# EAGLE design SwitchCanaleDP2024 (EAGLE 6.5.0)
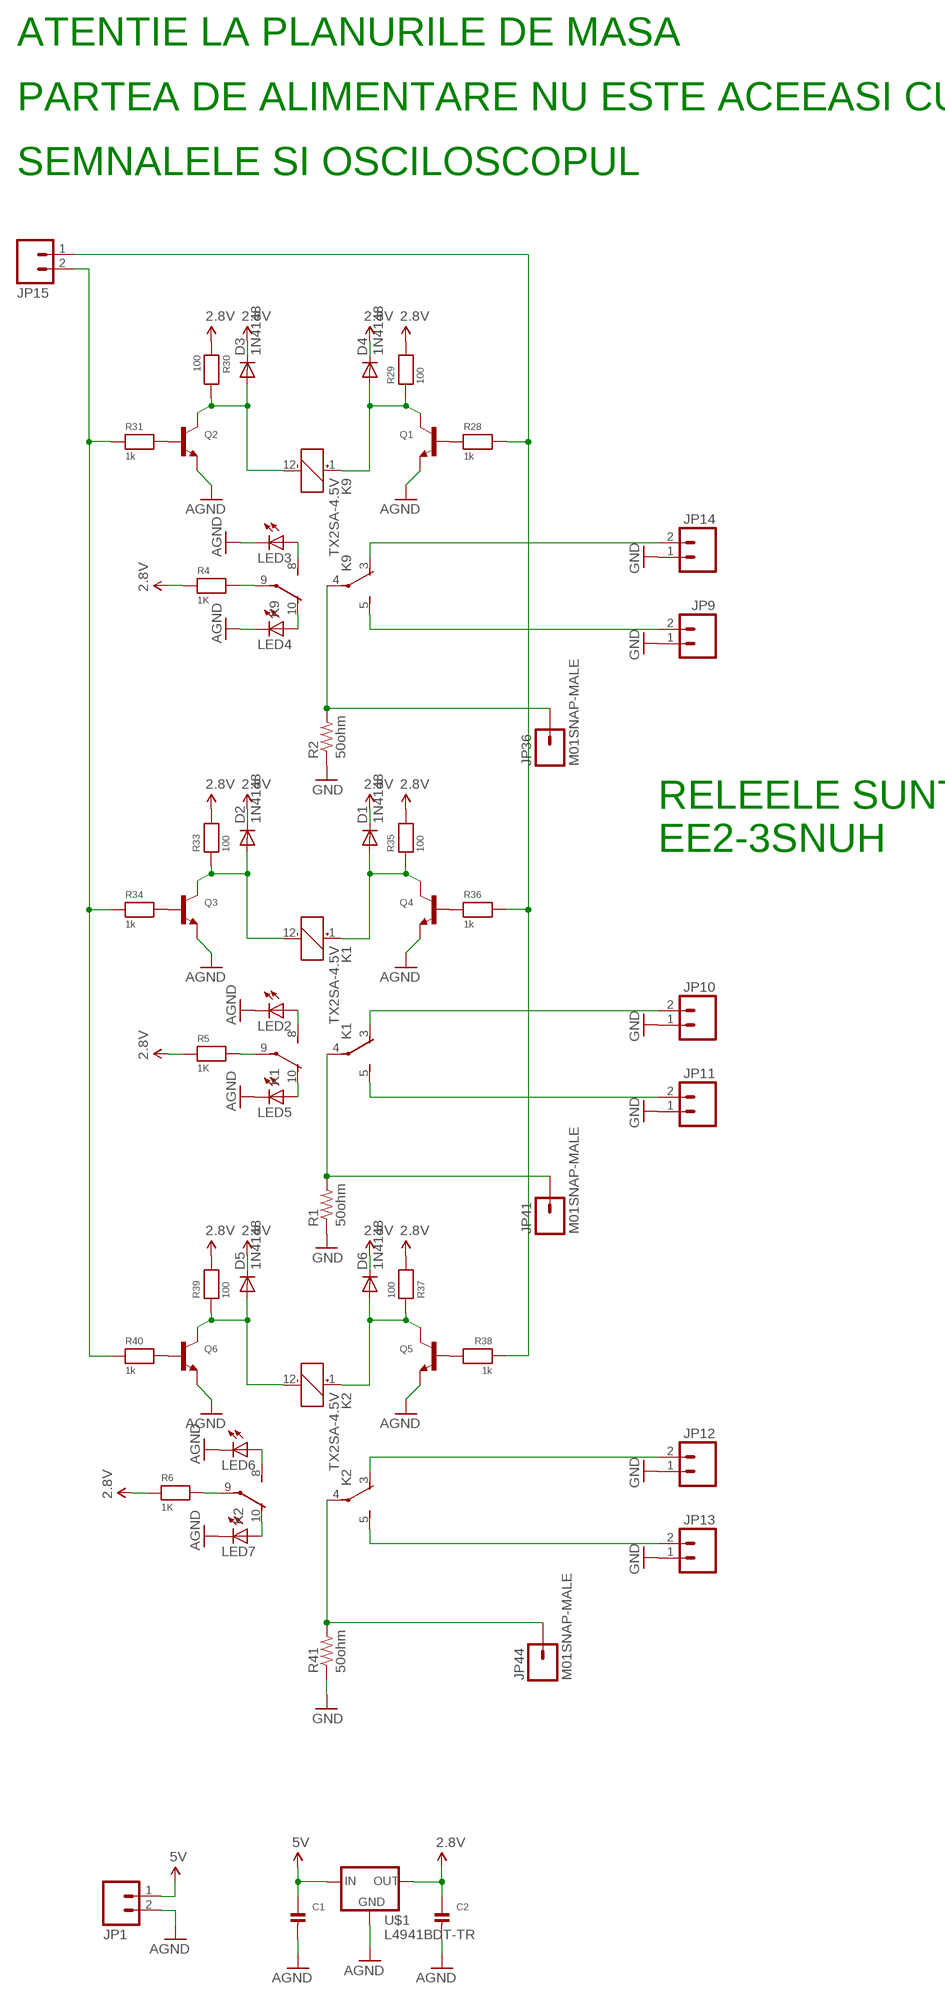
[diagram p0: schematic, sheet 1]

## Parts
C1  CAP_CERAMIC1206  [1206]
C2  CAP_CERAMIC1206  [1206]
D1  1N4148  DIODE-MINIMELF  [MINIMELF]
D2  1N4148  DIODE-MINIMELF  [MINIMELF]
D3  1N4148  DIODE-MINIMELF  [MINIMELF]
D4  1N4148  DIODE-MINIMELF  [MINIMELF]
D5  1N4148  DIODE-MINIMELF  [MINIMELF]
D6  1N4148  DIODE-MINIMELF  [MINIMELF]
JP1  M025MM  [SCREWTERMINAL-5MM-2]
JP9  M025MM  [SCREWTERMINAL-5MM-2]
JP10  M025MM  [SCREWTERMINAL-5MM-2]
JP11  M025MM  [SCREWTERMINAL-5MM-2]
JP12  M025MM  [SCREWTERMINAL-5MM-2]
JP13  M025MM  [SCREWTERMINAL-5MM-2]
JP14  M025MM  [SCREWTERMINAL-5MM-2]
JP15  M025MM  [SCREWTERMINAL-5MM-2]
JP36  M01SNAP-MALE  [SNAP-MALE]
JP41  M01SNAP-MALE  [SNAP-MALE]
JP44  M01SNAP-MALE  [SNAP-MALE]
K1  TX2SA-4.5V  [TX2SA]
K2  TX2SA-4.5V  [TX2SA]
K9  TX2SA-4.5V  [TX2SA]
LED2  LEDCHIP-LED0805  [CHIP-LED0805]
LED3  LEDCHIP-LED0805  [CHIP-LED0805]
LED4  LEDCHIP-LED0805  [CHIP-LED0805]
LED5  LEDCHIP-LED0805  [CHIP-LED0805]
LED6  LEDCHIP-LED0805  [CHIP-LED0805]
LED7  LEDCHIP-LED0805  [CHIP-LED0805]
Q1  TRANSISTOR_NPNWAVE  [SOT23-W]
Q2  TRANSISTOR_NPNWAVE  [SOT23-W]
Q3  TRANSISTOR_NPNWAVE  [SOT23-W]
Q4  TRANSISTOR_NPNWAVE  [SOT23-W]
Q5  TRANSISTOR_NPNWAVE  [SOT23-W]
Q6  TRANSISTOR_NPNWAVE  [SOT23-W]
R1  50ohm  RESISTOR1206  [1206]
R2  50ohm  RESISTOR1206  [1206]
R4  1K  RESISTOR_0805MP  [_0805MP]
R5  1K  RESISTOR_0805MP  [_0805MP]
R6  1K  RESISTOR_0805MP  [_0805MP]
R28  1k  RESISTOR_0805MP  [_0805MP]
R29  100  RESISTOR_0805MP  [_0805MP]
R30  100  RESISTOR_0805MP  [_0805MP]
R31  1k  RESISTOR_0805MP  [_0805MP]
R33  100  RESISTOR_0805MP  [_0805MP]
R34  1k  RESISTOR_0805MP  [_0805MP]
R35  100  RESISTOR_0805MP  [_0805MP]
R36  1k  RESISTOR_0805MP  [_0805MP]
R37  100  RESISTOR_0805MP  [_0805MP]
R38  1k  RESISTOR_0805MP  [_0805MP]
R39  100  RESISTOR_0805MP  [_0805MP]
R40  1k  RESISTOR_0805MP  [_0805MP]
R41  50ohm  RESISTOR1206  [1206]
U$1  L4941BDT-TR  [DPAK]

## Nets
2.8V: C2.1 D1.C D2.C D3.C D4.C D5.C D6.C R4.1 R5.1 R6.1 R29.2 R30.1 R33.2 R35.2 R37.2 R39.2 U$1.2(OUT)
5V: C1.1 JP1.1 U$1.1(IN)
AGND: C1.2 C2.2 JP1.2 LED2.C LED3.C LED4.C LED5.C LED6.C LED7.C Q1.2(E) Q2.2(E) Q3.2(E) Q4.2(E) Q5.2(E) Q6.2(E) U$1.3(GND)
GND: JP9.1 JP10.1 JP11.1 JP12.1 JP13.1 JP14.1 R1.1 R2.1 R41.1
N$1: JP15.2 R31.1 R34.1 R40.1
N$2: D4.A K9.1(_:+) Q1.3(C) R29.1
N$3: K9.8(2:S) LED3.A
N$4: K9.10(2:O) LED4.A
N$5: K9.9(2:P) R4.2
N$6: JP14.2 K9.3(1:O)
N$7: JP9.2 K9.5(1:S)
N$8: JP15.1 R28.2 R36.2 R38.1
N$9: JP12.2 K2.3(1:O)
N$11: K1.8(2:S) LED2.A
N$12: K1.10(2:O) LED5.A
N$13: K2.8(2:S) LED6.A
N$14: K2.10(2:O) LED7.A
N$15: K2.9(2:P) R6.2
N$16: JP36.2 K9.4(1:P) R2.2
N$17: K1.9(2:P) R5.2
N$20: D1.A K1.1(_:+) Q4.3(C) R35.1
N$21: D2.A K1.12(_:-) Q3.3(C) R33.1
N$22: JP10.2 K1.3(1:O)
N$23: JP11.2 K1.5(1:S)
N$24: JP41.2 K1.4(1:P) R1.2
N$29: D6.A K2.1(_:+) Q5.3(C) R37.1
N$32: JP13.2 K2.5(1:S)
N$33: JP44.2 K2.4(1:P) R41.2
N$38: Q5.1(B) R38.2
N$39: Q6.1(B) R40.2
N$40: D5.A K2.12(_:-) Q6.3(C) R39.1
N$41: D3.A K9.12(_:-) Q2.3(C) R30.2
N$42: Q2.1(B) R31.2
N$43: Q1.1(B) R28.1
N$46: Q3.1(B) R34.2
N$49: Q4.1(B) R36.1

## Notes on the sheet
- ATENTIE LA PLANURILE DE MASA
- PARTEA DE ALIMENTARE NU ESTE ACEEASI CU
- SEMNALELE SI OSCILOSCOPUL
- RELEELE SUNT
- EE2-3SNUH

## Library data of the parts
C1 C2 = microbuilder:CAP_CERAMIC: Ceramic Capacitors 0402 - 0402 Surface Mount Capacitors 16pF 50V 5% [Digikey: 445-4899-2-ND] 18pF 50V 5% [Digikey: 490-1281-2-ND] 22pF 50V 5% [Digikey: 490-1283-2-ND] 68pF 50V 5% [Digikey: 490-1289-2-ND] 0.1uF 10V 10% [Digikey: 490-1318-2-ND] 1.0uF 6.3V 10% [Digikey: 490-1320-2-ND] 0603 - 0603 Surface Mount Capacitors 16 pF 50V 5% [Digikey: 445-5051-2-ND] 22 pF 50V [Digikey: PCC220ACVTR-ND] 33 pF 50V 5% [Digikey: 490-1415-1-ND] 56pF 50V 5% [Digikey: 490-1421-1-ND] 220pF 50V 5% [Digikey: 445-1285-1-ND] 680 pF 50V 2200 pF 50V 5% C0G [Digikey: 445-1297-1-ND] 5600 pF 100V 5% X7R [Digikey: 478-3711-1-ND] 0.1 µF 25V 10% [Digikey: PCC2277TR-ND] 0.22 µF 16V 10% X7R [Digikey: 445-1318-1-ND] 1.0 µF 25V 10% [Digikey: 445-5146-2-ND] 0603 - RF Specific 3pF 250V +/-0.1pF RF [Digikey: 712-1347-1-ND] 18 pF 250V 5% [Digikey: 478-3505-1-ND or 712-1322-1-ND] 56 pF 250V 5% C0G RF [Digikey: 490-4867-1-ND] 68 pF 250V RF [Digikey: 490-4868-1-ND] 0805 - 0805 Surface Mount Capacitors 220 pF 250V 2% RF Ceramic Capacitor [Digikey: 712-1398-1-ND] 1000 pF 50V 2% NP0 Ceramic Capacitor [Digikey: 478-3760-1-ND] 0.1 µF 25V 10% Ceramic Capacitor [Digikey: PCC1828TR-ND] 1.0 µF 16V 10% Ceramic Capacitor[Digikey: 490-1691-2-ND] 10.0 µF 10V 10% Ceramic Capacitor[Digikey: 709-1228-1-ND] 10.0 uF 16V 10% Ceramic Capacitor [Digikey: 478-5165-2-ND] 47 uF 6.3V 20% Ceramic Capacitor [Digikey: 587-1779-1-ND or 399-5506-1-ND] 1206 - 1206 Surface Mount Capacitors 47uF 10V 20% Ceramic Capacitor [Digikey: 490-5528-1-ND or 399-5508-1-ND or 445-6010-1-ND] 100uF 6.3V -20%, +80% Y5V Ceramic Capacitor (Digikey: 490-4512-1-ND, Mouser: 81-GRM31CF50J107ZE1L)
D1-D6 = diode:DIODE-: DIODE
JP1 JP9-JP15 = SparkFun-Connectors:M02: Header 2 Standard 2-pin 0.1" header. Use with straight break away headers (SKU : PRT-00116), right angle break away headers (PRT-00553), swiss pins (PRT-00743), machine pins (PRT-00117), and female headers (PRT-00115). Molex polarized connector foot print use with SKU : PRT-08233 with associated crimp pins and housings.
JP36 JP41 JP44 = SparkFun-Connectors:M01: Header 1 Standard 1-pin 0.1" header. Use with straight break away headers (SKU : PRT-00116), right angle break away headers (PRT-00553), swiss pins (PRT-00743), machine pins (PRT-00117), and female headers (PRT-00115).
K1 K2 K9 = relay:TX2?-*: 2 AMP. HIGH CAPACITY RELAY NAiS WITH HIGH SURGE VOLTAGE & HIGH BREAKDOWN VOLTAGE Source: http://www.mew-europe.com/.. en_ds_61022_0001.pdf; MF: AROMAT/ MATSUSHITA; MPN: TX2SA-4.5V; OC_FARNELL: unknown; OC_NEWARK: 92F1604
LED2-LED7 = led:LED: LED OSRAM: - CHIPLED LG R971, LG N971, LY N971, LG Q971, LY Q971, LO R971, LY R971 LH N974, LH R974 LS Q976, LO Q976, LY Q976 LO Q996 - Hyper CHIPLED LW Q18S LB Q993, LB Q99A, LB R99A - SideLED LS A670, LO A670, LY A670, LG A670, LP A670 LB A673, LV A673, LT A673, LW A673 LH A674 LY A675 LS A676, LA A676, LO A676, LY A676, LW A676 LS A679, LY A679, LG A679 - Hyper Micro SIDELED® LS Y876, LA Y876, LO Y876, LY Y876 LT Y87S - SmartLED LW L88C, LW L88S LB L89C, LB L89S, LG L890 LS L89K, LO L89K, LY L89K LS L896, LA L896, LO L896, LY L896 - TOPLED LS T670, LO T670, LY T670, LG T670, LP T670 LSG T670, LSP T670, LSY T670, LOP T670, LYG T670 LG T671, LOG T671, LSG T671 LB T673, LV T673, LT T673, LW T673 LH T674 LS T676, LA T676, LO T676, LY T676, LB T676, LH T676, LSB T676, LW T676 LB T67C, LV T67C, LT T67C, LS T67K, LO T67K, LY T67K, LW E67C LS E67B, LA E67B, LO E67B, LY E67B, LB E67C, LV E67C, LT E67C LW T67C LS T679, LY T679, LG T679 LS T770, LO T770, LY T770, LG T770, LP T770 LB T773, LV T773, LT T773, LW T773 LH T774 LS E675, LA E675, LY E675, LS T675 LS T776, LA T776, LO T776, LY T776, LB T776 LHGB T686 LT T68C, LB T68C - Hyper Mini TOPLED® LB M676 - Mini TOPLED Santana® LG M470 LS M47K, LO M47K, LY M47K Source: http://www.osram.convergy.de LUXEON: - LUMILED® LXK2-PW12-R00, LXK2-PW12-S00, LXK2-PW14-U00, LXK2-PW14-V00 LXK2-PM12-R00, LXK2-PM12-S00, LXK2-PM14-U00 LXK2-PE12-Q00, LXK2-PE12-R00, LXK2-PE12-S00, LXK2-PE14-T00, LXK2-PE14-U00 LXK2-PB12-K00, LXK2-PB12-L00, LXK2-PB12-M00, LXK2-PB14-N00, LXK2-PB14-P00, LXK2-PB14-Q00 LXK2-PR12-L00, LXK2-PR12-M00, LXK2-PR14-Q00, LXK2-PR14-R00 LXK2-PD12-Q00, LXK2-PD12-R00, LXK2-PD12-S00 LXK2-PH12-R00, LXK2-PH12-S00 LXK2-PL12-P00, LXK2-PL12-Q00, LXK2-PL12-R00 Source: www.luxeon.com KINGBRIGHT: KA-3528ASYC Source: www.kingbright.com
Q1-Q6 = microbuilder:TRANSISTOR_NPN: NPN Transistor Transistor (NPN) 500mA 45V - BC817 [Digikey: 568-1631-1-ND] Transistor (NPN) 500mA 45V - BC817,215 [Mouser: 771-BC817-T/R] SOT23-R - SOT23 footprint optimised for use with solder paste and reflow ovens. SOT23-W - SOT23 footprint optimised for hand-soldering (larger pads).
R1 R2 R41 = SparkFun-Passives:RESISTOR: Resistor Basic schematic elements and footprints for 0603, 1206, and PTH resistors.
R4-R6 R28-R31 R33-R40 = microbuilder:RESISTOR: Resistors 0402 - 0402 Surface Mount Package 22 Ohm 1% 1/16W [Digikey: 311-22.0LRTR-ND] 33 Ohm 5% 1/16W 1.0K 5% 1/16W 1.5K 5% 1/16W 2.0K 1% 1/16W 10.0K 1% 1/16W [Digikey: 311-10.0KLRTR-ND] 10.0K 5% 1/16W [Digikey: RMCF0402JT10K0TR-ND] 12.1K 1% 1/16W [Digikey: 311-22.0LRTR-ND] 100.0K 5% 1/16W 0603 - 0603 Surface Mount Package 0 Ohm 1/10 Watt 1% Resistor 15 Ohm 1/10 Watt 1% Resistor 33 Ohm 1/10 Watt 1% Resistor 49.9 Ohm 1/10 Watt 1% Resistor 100 Ohm 1/10 Watt 1% Resistor 150 Ohm 1/10 Watt 1% Resistor 240 Ohm 1/10 Watt 1% Resistor 390 Ohm 1/10 Watt 1% Resistor 560 Ohm 1/10 Watt 1% Resistor 680 Ohm 1/10 Watt 1% Resistor 750 Ohm 1/10 Watt 1% Resistor 1.0K Ohm 1/10 Watt 1% Resistor 1.5K Ohm 1/10 Watt 1% Resistor 2.0K Ohm 1/10 Watt 1% Resistor 2.2K Ohm 1/10 Watt 1% Resistor 3.3K Ohm 1/10 Watt 1% Resistor 4.7K Ohm 1/10 Watt 1% Resistor 10.0K Ohm 1/10 Watt 1% Resistor 12.0K Ohm 1/10 Watt 1% Resistor 12.1K Ohm 1/10 Watt 1% Resistor 20.0K Ohm 1/10 Watt 1% Resistor 33.0K Ohm 1/10 Watt 1% Resistor 100.0K Ohm 1/10 Watt 1% Resistor 0805 - 0805 Surface Mount Package 0 Ohm 1/8 Watt 1% Resistor 33 Ohm 1/8 Watt 1% Resistor 100 Ohm 1/8 Watt 1% Resistor 150 Ohm 1/8 Watt 1% Resistor 200 Ohm 1/8 Watt 1% Resistor 240 Ohm 1/8 Watt 1% Resistor 330 Ohm 1/8 Watt 1% Resistor 390 Ohm 1/8 Watt 1% Resistor 470 Ohm 1/8 Watt 1% Resistor 1.0K Ohm 1/8 Watt 1% Resistor 1.5K Ohm 1/8 Watt 1% Resistor 2.0K Ohm 1/8 Watt 1% Resistor 4.7K Ohm 1/8 Watt 1% Resistor 5.1K Ohm 1/8 Watt 1% Resistor 5.6K Ohm 1/8 Watt 1% Resistor 10.0K Ohm 1/8 Watt 1% Resistor 22.0K Ohm 1/8 Watt 1% Resistor 33.0K Ohm 1/8 Watt 1% Resistor 100K Ohm 1/8 Watt 1% Resistor 1206 - 1206 Surface Mount Package 2012 - 2010 Surface Mount Package 0.11 Ohm 1/2 Watt 1% Resistor - Digikey: RHM.11UCT-ND
U$1 = mes:L4941: LD4941 LDO 1A Regulator ST Microelectronics The L4941 is a three terminal 5V positive regulators available in TO-220 and DPAK packages, making it useful in a wide range of industrial and consumer applications. Thanks to its very low input/output voltage drop, these devices are particularly suitable for battery powered equipments, reducing consumption and prolonging battery life. It employs internal current limiting, antisaturation circuit, thermal shut-down and safe area protection. Reference: http://www.st.com/stonline/books/pdf/docs/2142.pdf

## Board
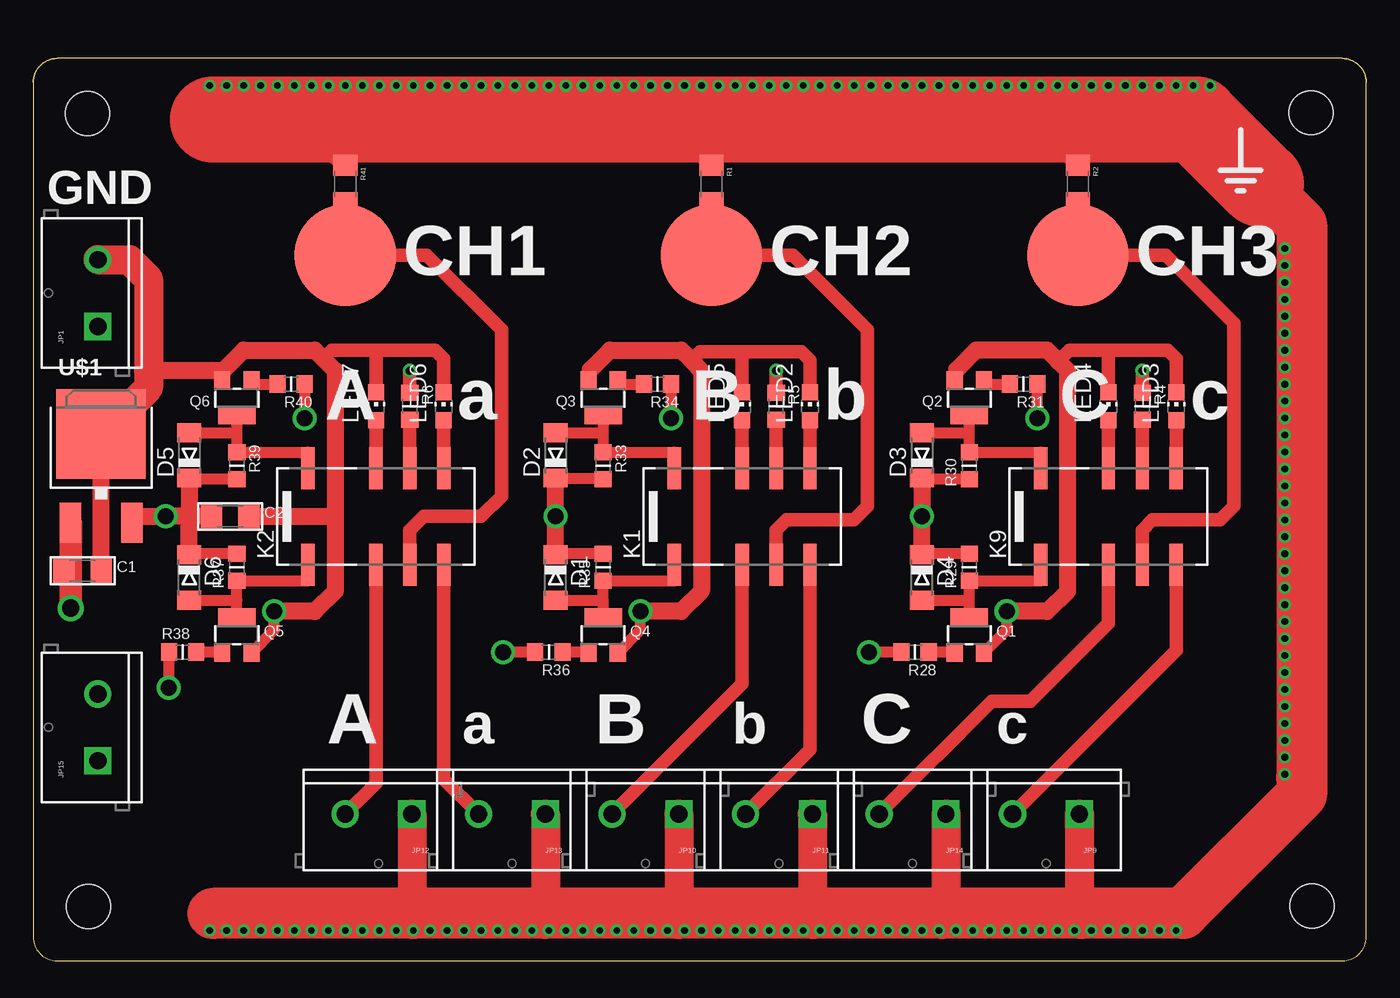
[diagram p1: board, top side]
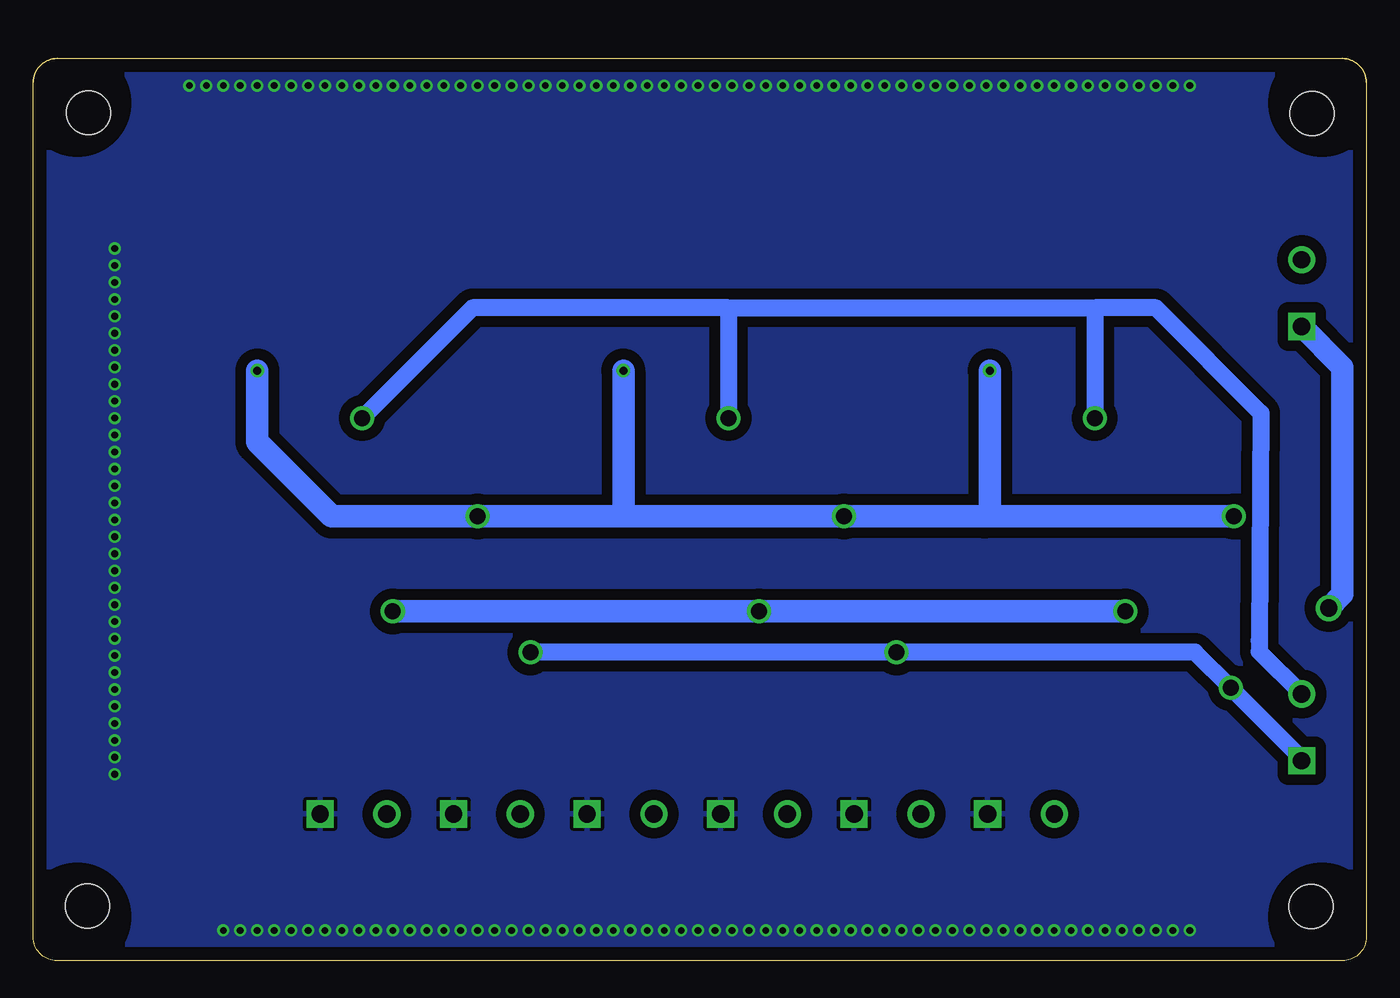
[diagram p2: board, bottom side, seen from below]

Size 99.82 x 67.56 mm. Coordinates in mm from the lower left corner, seen from the top.
Outline: 0,65.79 0,1.78
Outline: 99.82,1.78 99.82,65.79
Outline: 98.04,67.56 1.78,67.56
Outline: 0,1.78 arc90 1.78,0
Outline: 1.78,0 98.04,0
Outline: 98.04,0 arc90 99.82,1.78
Outline: 0,65.79 arc-90 1.78,67.56
Outline: 98.04,67.56 arc-90 99.82,65.79
Outline: 0,1.78 arc90 1.78,0
Outline: 99.82,65.79 arc90 98.04,67.56
Outline: 1.78,67.56 arc90 0,65.79
Outline: 98.04,0 arc90 99.82,1.78
Copper layers (1*16): Top 0.035mm / dielectric 1.5mm / Bottom 0.035mm
Design rules "default *": minimum track width 10mil, minimum drill 24mil, track to track 8mil, track to pad 8mil, pad to pad 8mil, via to via 8mil, smd to smd 8mil, copper to edge 40mil, drill to drill 8mil, minimum pad ring 10mil, minimum via ring 8mil, stop-mask expansion 4mil, vias tented up to drill 0mil, thermal gap 10mil
tKeepout: 1 lines
tRestrict: 1 lines
bRestrict: area 0.3,61.2 to 6.3,67.3; area 0.3,0.3 to 6.3,6.3; area 93.5,0.3 to 99.5,6.3; area 93.5,61.2 to 99.5,67.3

### Footprints (pad centres in the part's own frame; a part is rotated, then mirrored left to right if it is on the bottom)
1206 = smd 1.6 x 1.8: 1 -1.4,0; 2 1.4,0
MINIMELF = smd 1.4 x 1.8: A 1.7,0; C -1.7,0
SCREWTERMINAL-5MM-2 = drill 1.3 pad 2.032 square: 1 0,0 | drill 1.3 pad 2.032: 2 5,0
SNAP-MALE = smd 7.62 x 7.62: 2 0,0
TX2SA = smd 1 x 3.16: 1 -5.08,-3.62; 3 0,-3.62; 4 2.54,-3.62; 5 5.08,-3.62; 8 5.08,3.62; 9 2.54,3.62; 10 0,3.62; 12 -5.08,3.62
CHIP-LED0805 = smd 1.2 x 1.2: A 0,-1.05; C 0,1.05
SOT23-W = smd 1.2 x 1.4: 1 -1.1,-1.3; 2 1.1,-1.3 | smd 2.8 x 1.4: 3 0,1.3
_0805MP = smd 1.2 x 1.3: 1 -1.016,0; 2 1.016,0
STAND-OFF = hole 3.302: 0,0
DPAK = smd 1.6 x 3: 1 -2.3,-4.8; 2 2.3,-4.8 | smd 6.7 x 6.7: 3 0,1.86

### Placement (x,y rotation side)
C1  3.68,29.21 0 top
C2  14.73,33.27 0 top
D1  39.12,28.7 270 top
D2  39.12,37.85 90 top
D3  66.55,37.85 90 top
D4  66.55,28.7 270 top
D5  11.68,37.85 90 top
D6  11.68,28.7 270 top
JP1  4.83,47.5 90 top
JP9  78.35,11 180 top
JP10  48.35,11 180 top
JP11  58.35,11 180 top
JP12  28.35,11 180 top
JP13  38.35,11 180 top
JP14  68.35,11 180 top
JP15  4.83,14.99 90 top
JP36  78.23,52.83 180 top
JP41  50.8,52.83 180 top
JP44  23.37,52.83 180 top
K1  53.09,33.27 0 top
K2  25.65,33.27 0 top
K9  80.52,33.27 0 top
LED2  58.17,41.53 0 top
LED3  85.6,41.53 0 top
LED4  80.52,41.53 0 top
LED5  53.09,41.53 0 top
LED6  30.73,41.53 0 top
LED7  25.65,41.53 0 top
Q1  70.1,24.38 0 top
Q2  70.1,42.16 180 top
Q3  42.67,42.16 180 top
Q4  42.67,24.38 0 top
Q5  15.24,24.38 0 top
Q6  15.24,42.16 180 top
R1  50.8,58.17 270 top
R2  78.23,58.17 270 top
R4  83.06,41.53 270 top
R5  55.63,41.53 270 top
R6  28.19,41.53 270 top
R28  66.04,23.11 180 top
R29  70.1,29.46 90 top
R30  70.1,37.08 90 top
R31  74.17,43.18 180 top
R33  42.67,37.08 270 top
R34  46.74,43.18 180 top
R35  42.67,29.46 90 top
R36  38.61,23.11 180 top
R37  15.24,29.46 90 top
R38  11.18,23.11 0 top
R39  15.24,37.08 270 top
R40  19.3,43.18 180 top
R41  23.37,58.17 270 top
STANDOFF2  STAND-OFF  [STAND-OFF]  4.11,4.06 180 bottom
STANDOFF3  STAND-OFF  [STAND-OFF]  95.71,63.5 0 bottom
STANDOFF4  STAND-OFF  [STAND-OFF]  4.06,63.45 270 bottom
STANDOFF5  STAND-OFF  [STAND-OFF]  95.76,4.11 90 bottom
U$1  5.08,37.59 0 top

### Tracks (layer width: path | path; a pad name or v marks a point on that pad's centre or on a via)
2.8V  (via drill 0.6, 1.2)
  Top 0.813: 11.68,35.93 D5.C 11.68,36.07 R39.2 | 39.12,35.93 D2.C 42.67,36.15 R33.2 | R35.2 39.12,30.48 D1.C | R37.2 11.68,30.48 D6.C | R30.1 66.55,36.07 D3.C | R29.2 66.55,30.48 D4.C
  Top 1.016: R4.1 v83.06,44.2 | R5.1 v55.63,44.2 | R6.1 v28.19,44.2
  Top 1.27: C2.1 11.68,33.27 | 11.68,33.27 v9.91,33.27 8.38,33.27 7.38,33.27 U$1.2 | 11.68,35.93 11.68,33.27 | 11.68,30.48 11.68,33.27 | D2.C v39.12,33.27 39.12,30.48 | 66.55,36.07 v66.55,33.27 66.55,30.48
  Bottom 1.016: 55.63,33.4 55.5,33.27 | 28.19,33.66 28.57,33.27
  Bottom 1.676: v9.91,33.27 28.57,33.27 v39.12,33.27 55.5,33.27 v66.55,33.27 77.47,33.27 83.06,38.86 v83.06,44.2 | v55.63,44.2 55.63,33.4 | v28.19,44.2 28.19,33.66
5V  (via drill 1.3)
  Top 0.305: C1.1 2.28,29.34 2.78,29.34
  Top 1.676: U$1.1 2.78,29.34 v2.79,26.42
  Bottom 1.676: v2.79,26.42 1.78,27.43 1.78,44.45 JP1.1
AGND  (via drill 1.2)
  Top 0.813: Q3.2 41.72,44.26 | 69.15,44.26 Q2.2 | Q6.2 14.29,43.62 14.22,44.2 | Q4.2 45.47,24.78 v45.47,26.16 | Q1.2 72.9,24.78 v72.9,26.16 | Q5.2 18.03,24.78 v18.03,26.16 | C1.2
  Top 1.016: LED3.C 85.6,45.09 84.96,45.72 80.39,45.72 | 80.39,45.72 77.6,45.72 76.77,44.9 | LED4.C 80.52,45.59 80.39,45.72 | LED2.C 58.17,44.96 57.53,45.59 53.09,45.59 | 53.09,45.59 49.91,45.59 49.28,44.96 | LED6.C 30.73,45.09 30.1,45.72 25.53,45.72 | 25.53,45.72 22.35,45.72 21.72,45.09 | LED7.C 25.65,45.59 25.53,45.72 | LED5.C 53.09,45.59
  Top 1.27: 22.61,33.27 22.61,44.2 21.72,45.09 21.08,45.72 15.75,45.72 14.22,44.2 8.64,44.2 | 22.61,33.27 22.61,27.69 21.08,26.16 v18.03,26.16 | 41.72,44.26 43.18,45.72 48.51,45.72 49.28,44.96 50.04,44.2 50.04,27.69 48.51,26.16 v45.47,26.16 | 69.15,44.26 70.61,45.72 75.95,45.72 76.77,44.9 77.47,44.2 77.47,27.69 75.95,26.16 v72.9,26.16 | C1.2 U$1.3 | C2.2 22.61,33.27
  Top 2.184: JP1.2 7.19,52.5 8.64,51.05 8.64,44.2 8.64,42.93 7.37,41.66 7.28,41.66 U$1.3
  Bottom 1.676: v18.03,26.16 v45.47,26.16 v72.9,26.16
GND  (via drill 0.5)
  Top 0.406: 28.45,3.56 v28.45,2.29 | v86.87,65.53 86.87,62.99
  Top 1.016: R1.1 46.74,62.99 | R41.1 19.3,62.48 arc-90 19.81,62.99 | R2.1 74.17,62.99 | v93.73,13.97 94.74,13.97 95,13.72
  Top 2.184: JP12.1 28.35,4.32 28.45,4.32 28.45,3.56 | JP13.1 38.35,3.56 | JP10.1 48.35,3.56 48.26,3.56 | JP11.1 58.35,3.56 58.42,3.56 | JP14.1 68.35,3.56 68.07,3.56 | JP9.1 78.35,3.56 78.49,3.56
  Top 3.81: 13.46,3.56 28.45,3.56 38.35,3.56 48.26,3.56 58.42,3.56 68.07,3.56 78.49,3.56 86.11,3.56 95,12.45 95,13.72 95,55.12 91.95,58.17
  Top 6.452: 13.46,62.99 19.81,62.99 46.74,62.99 74.17,62.99 86.87,62.99 87.12,62.99 91.95,58.17
  other vias: 13.21,65.53 14.48,65.53 15.75,65.53 17.02,65.53 20.83,65.53 22.1,65.53 19.56,65.53 18.29,65.53 25.91,65.53 23.37,65.53 24.64,65.53 27.18,65.53 28.45,65.53 29.72,65.53 30.99,65.53 32.26,65.53 33.53,65.53 34.8,65.53 36.07,65.53 37.34,65.53 38.61,65.53 47.5,65.53 48.77,65.53 50.04,65.53 52.58,65.53 51.31,65.53 56.39,65.53 39.88,65.53 41.15,65.53 42.42,65.53 43.69,65.53 44.96,65.53 46.23,65.53 57.66,65.53 58.93,65.53 60.2,65.53 61.47,65.53 62.74,65.53 64.01,65.53 55.12,65.53 53.85,65.53 69.09,65.53 70.36,65.53 71.63,65.53 74.17,65.53 72.9,65.53 77.98,65.53 65.28,65.53 66.55,65.53 67.82,65.53 79.25,65.53 80.52,65.53 81.79,65.53 83.06,65.53 84.33,65.53 85.6,65.53 76.71,65.53 75.44,65.53 88.14,65.53 81.79,2.29 83.06,2.29 84.33,2.29 85.6,2.29 77.98,2.29 79.25,2.29 80.52,2.29 93.73,15.24 60.2,2.29 61.47,2.29 62.74,2.29 65.28,2.29 64.01,2.29 69.09,2.29 56.39,2.29 57.66,2.29 58.93,2.29 70.36,2.29 71.63,2.29 72.9,2.29 74.17,2.29 75.44,2.29 76.71,2.29 67.82,2.29 66.55,2.29 38.61,2.29 39.88,2.29 41.15,2.29 43.69,2.29 42.42,2.29 47.5,2.29 34.8,2.29 36.07,2.29 37.34,2.29 48.77,2.29 50.04,2.29 51.31,2.29 52.58,2.29 53.85,2.29 55.12,2.29 46.23,2.29 44.96,2.29 17.02,2.29 18.29,2.29 19.56,2.29 22.1,2.29 20.83,2.29 25.91,2.29 13.21,2.29 14.48,2.29 15.75,2.29 27.18,2.29 29.72,2.29 30.99,2.29 32.26,2.29 33.53,2.29 24.64,2.29 23.37,2.29 93.73,20.32 93.73,21.59 93.73,22.86 93.73,25.4 93.73,24.13 93.73,29.21 93.73,16.51 93.73,17.78 93.73,19.05 93.73,30.48 93.73,31.75 93.73,33.02 93.73,34.29 93.73,35.56 93.73,36.83 93.73,27.94 93.73,26.67 93.73,41.91 93.73,43.18 93.73,44.45 93.73,46.99 93.73,45.72 93.73,50.8 93.73,38.1 93.73,39.37 93.73,40.64 93.73,52.07 93.73,53.34 93.73,49.53 93.73,48.26
  pour Bottom (isolate 0.813): 0,67.56 99.82,67.56 99.82,0 0,0
N$1  (via drill 1.2)
  Top 0.813: R40.1 v20.33,40.64 | R34.1 v47.76,40.64 | v75.19,40.64 R31.1
  Bottom 1.27: 47.76,48.9 66.94,48.9 v75.19,40.64 | 47.76,48.9 v47.76,40.64 | 47.76,48.9 20.33,48.9 | 20.33,48.9 15.75,48.9 7.87,41.02 8,24 8,23.16 JP15.2 | 20.33,48.9 v20.33,40.64
N$2
  Top 0.813: Q1.3 70.1,27 | 70.1,27 R29.1 75.44,28.45 K9.1 | D4.A 70.1,27
N$3
  Top 1.016: LED3.A K9.8
N$4
  Top 1.016: LED4.A K9.10
N$5
  Top 1.016: R4.2 K9.9
N$6
  Top 1.016: K9.3 80.52,25.27 74.68,19.43 71.78,19.43 JP14.2
N$7
  Top 1.016: K9.5 85.6,23.25 JP9.2
N$8  (via drill 1.2)
  Top 0.813: R28.2 v62.6,23.11 | R36.2 v35.17,23.11 | R38.1 10.15,23.1 v10.15,20.45
  Bottom 1.27: v62.6,23.11 v35.17,23.11 12.82,23.11 v10.15,20.45 4.83,15.12 JP15.1
N$9
  Top 1.016: K2.3 25.65,13.3 JP12.2
N$11
  Top 1.016: LED2.A K1.8
N$12
  Top 1.016: LED5.A K1.10
N$13
  Top 1.016: LED6.A K2.8
N$14
  Top 1.016: LED7.A K2.10
N$15
  Top 1.016: R6.2 K2.9
N$16
  Top 1.016: R2.2 JP36.2 84.84,52.83 89.92,47.75 89.92,34.04 88.9,33.02 83.82,33.02 83.06,32.26 K9.4
N$17
  Top 1.016: R5.2 K1.9
N$20
  Top 0.813: 42.67,27 R35.1 48.01,28.45 K1.1 | D1.A 42.67,27 | 42.67,27 Q4.3
N$21
  Top 0.813: Q3.3 42.67,39.55 | 42.67,39.55 R33.1 48.01,38.1 K1.12 | D2.A 42.67,39.55
N$22
  Top 1.016: K1.3 53.09,20.74 JP10.2
N$23
  Top 1.016: K1.5 58.17,15.82 JP11.2
N$24
  Top 1.016: R1.2 JP41.2 56.9,52.83 62.48,47.24 62.48,34.04 61.47,33.02 56.39,33.02 55.63,32.26 K1.4
N$29
  Top 0.813: Q5.3 15.24,27 | 15.24,27 R37.1 20.57,28.45 K2.1 | D6.A 15.24,27
N$32
  Top 1.016: K2.5 30.73,13.62 JP13.2
N$33
  Top 1.016: R41.2 JP44.2 29.46,52.83 35.05,47.24 35.05,34.8 33.53,33.27 29.21,33.27 28.19,32.26 K2.4
N$38
  Top 0.813: Q5.1 14.14,23.11 R38.2
N$39
  Top 0.813: Q6.1 16.27,43.18 R40.2
N$40
  Top 0.813: Q6.3 15.24,39.55 | 15.24,39.55 R39.1 20.57,38.1 K2.12 | D5.A 15.24,39.55
N$41
  Top 0.813: 70.1,39.55 R30.2 75.44,38.1 K9.12 | 70.1,39.55 Q2.3 | D3.A 70.1,39.55
N$42
  Top 0.813: Q2.1 71.14,43.18 R31.2
N$43
  Top 0.813: Q1.1 69,23.11 R28.1
N$46
  Top 0.813: Q3.1 43.71,43.18 R34.2
N$49
  Top 0.813: Q4.1 41.57,23.11 R36.1

### Text on the board
tPlace: GND | CH1 | CH2 | CH3 | A | a | B | b | C | c | A | a | B | b | C | c